# Altium schematic sheet FPGA.SchDoc
size A4; SheetNumber: 3; SheetTotal: 4
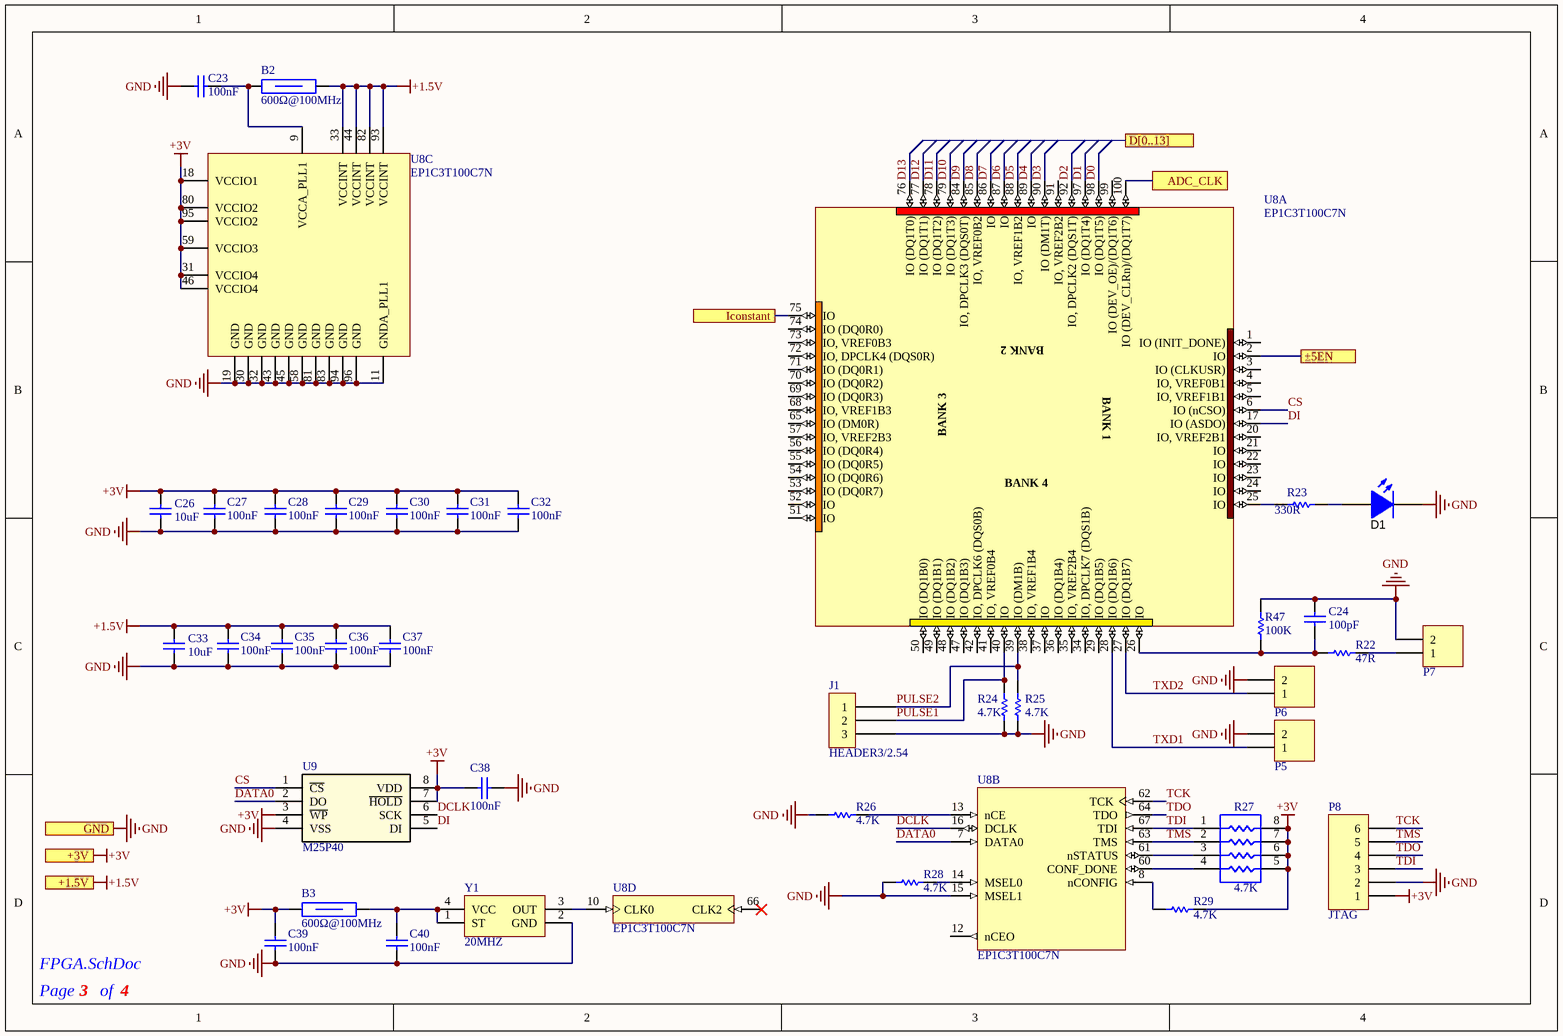
[diagram p0: FPGA.SchDoc]

## Parts
B2  600Ω@100MHz  [R0805_L]
B3  600Ω@100MHz  [R0805_L]
C23  100nF  [R0603_C]
C24  100pF  [R0603_C]
C26  10uF  [R0805_C]
C27  100nF  [R0603_C]
C28  100nF  [R0603_C]
C29  100nF  [R0603_C]
C30  100nF  [R0603_C]
C31  100nF  [R0603_C]
C32  100nF  [R0603_C]
C33  10uF  [R0805_C]
C34  100nF  [R0603_C]
C35  100nF  [R0603_C]
C36  100nF  [R0603_C]
C37  100nF  [R0603_C]
C38  100nF  [R0603_C]
C39  100nF  [R0603_C]
C40  100nF  [R0603_C]
D1  MHT192WDT-C2  [LED_0603_RED]  (value not drawn)
J1  HEADER3/2.54  [SIP3/2.54]
P5  Header 2  [CP1X2]  (value not drawn)
P6  Header 2  [CP1X2]  (value not drawn)
P7  Header 2  [CP1X2]  (value not drawn)
P8  JTAG  [CP1X6]
R22  47R  [R0603_R]
R23  330R  [R0603_R]
R24  4.7K  [R0603_R]
R25  4.7K  [R0603_R]
R26  4.7K  [R0603_R]
R27  4.7K  [R0603X4]
R28  4.7K  [R0603_R]
R29  4.7K  [R0603_R]
R47  100K  [R0603_R]
U8  EP1C3T100C7N  [TQFP100]  (parts A,B,C,D of 4)
U9  M25P40  [SOP-8_150mil]
Y1  20MHZ  [SMD-3225]

## Ports
+1.5V, +3V, ADC_CLK, D[0..13], GND, Iconstant, ±5EN

## Nets
+1.5V: B2.2 C33.1 C34.2 C35.2 C36.2 C37.2 U8.33(VCCINT) U8.44(VCCINT) U8.82(VCCINT) U8.93(VCCINT) ; port +1.5V
+3V: B3.1 C26.2 C27.2 C28.2 C29.2 C30.2 C31.2 C32.2 C38.2 C39.2 P8.1 R27.5 R27.6 R27.7 R27.8 R29.1 U8.18(VCCIO1) U8.31(VCCIO4) U8.46(VCCIO4) U8.59(VCCIO3) U8.80(VCCIO2) U8.95(VCCIO2) U9.3(~{WP}) U9.7(~{HOLD}) U9.8(VDD) ; port +3V
GND: C23.2 C24.1 C26.1 C27.1 C28.1 C29.1 C30.1 C31.1 C32.1 C33.2 C34.1 C35.1 C36.1 C37.1 C38.1 C39.1 C40.1 D1.2(K) J1.3 P5.2 P6.2 P7.2 P8.2 R24.2 R25.2 R26.2 R28.1 R47.1 U8.11(GNDA_PLL1) U8.15(MSEL1) U8.19(GND) U8.30(GND) U8.32(GND) U8.43(GND) U8.45(GND) U8.58(GND) U8.81(GND) U8.83(GND) U8.94(GND) U8.96(GND) U9.4(VSS) Y1.2(GND) ; port GND
ADC_CLK: U8.100(IO_(DEV_CLRn)/(DQ1T7)) ; port ADC_CLK
CS: U8.6(IO_(nCSO)) U9.1(~{CS})
D0: U8.98(IO_(DQ1T5))
D1: U8.97(IO_(DQ1T4))
D2: U8.92(IO,_DPCLK2_(DQS1T))
D3: U8.90(IO_(DM1T))
D4: U8.89(IO)
D5: U8.88(IO,_VREF1B2)
D6: U8.87(IO)
D7: U8.86(IO)
D8: U8.85(IO,_VREF0B2)
D9: U8.84(IO,_DPCLK3_(DQS0T))
D10: U8.79(IO_(DQ1T3))
D11: U8.78(IO_(DQ1T2))
D12: U8.77(IO_(DQ1T1))
D13: U8.76(IO_(DQ1T0))
DATA0: U8.7(DATA0) U9.2(DO)
DCLK: U8.16(DCLK) U9.6(SCK)
DI: U8.17(IO_(ASDO)) U9.5(DI)
Iconstant: U8.75(IO) ; port Iconstant
PULSE1: J1.2 R24.1 U8.40(IO)
PULSE2: J1.1 R25.1 U8.39(IO_(DM1B))
TCK: P8.6 U8.62(TCK)
TDI: P8.3 R27.1 U8.67(TDI)
TDO: P8.4 U8.64(TDO)
TMS: P8.5 R27.2 U8.63(TMS)
TXD1: P5.1 U8.28(IO_(DQ1B6))
TXD2: P6.1 U8.27(IO_(DQ1B7))
±5EN: U8.2(IO) ; port ±5EN
NetB2_1: B2.1 C23.1 U8.9(VCCA_PLL1)
NetB3_2: B3.2 C40.2 Y1.1(ST) Y1.4(VCC)
NetC24_2: C24.2 R22.1 R47.2 U8.26(IO)
NetD1_1: D1.1(A) R23.2
NetP7_1: P7.1 R22.2
NetR23_1: R23.1 U8.25(IO)
NetR26_1: R26.1 U8.13(nCE)
NetR27_3: R27.3 U8.61(nSTATUS)
NetR27_4: R27.4 U8.60(CONF_DONE)
NetR28_2: R28.2 U8.14(MSEL0)
NetR29_2: R29.2 U8.8(nCONFIG)
NetU8_10: U8.10(CLK0) Y1.3(OUT)

Not connected (* = marked no-connect by the designer): U8 1(IO_(INIT_DONE)) 3(IO_(CLKUSR)) 4(IO,_VREF0B1) 5(IO,_VREF1B1) 12(nCEO) 20(IO,_VREF2B1) 21(IO) 22(IO) 23(IO) 24(IO) 29(IO_(DQ1B5)) 34(IO,_DPCLK7_(DQS1B)) 35(IO,_VREF2B4) 36(IO_(DQ1B4)) 37(IO) 38(IO,_VREF1B4) 41(IO,_VREF0B4) 42(IO,_DPCLK6_(DQS0B)) 47(IO_(DQ1B3)) 48(IO_(DQ1B2)) 49(IO_(DQ1B1)) 50(IO_(DQ1B0)) 51(IO) 52(IO) 53(IO_(DQ0R7)) 54(IO_(DQ0R6)) 55(IO_(DQ0R5)) 56(IO_(DQ0R4)) 57(IO,_VREF2B3) 65(IO_(DM0R)) 66(CLK2)* 68(IO,_VREF1B3) 69(IO_(DQ0R3)) 70(IO_(DQ0R2)) 71(IO_(DQ0R1)) 72(IO,_DPCLK4_(DQS0R)) 73(IO,_VREF0B3) 74(IO_(DQ0R0)) 91(IO,_VREF2B2) 99(IO_(DEV_OE)/(DQ1T6))

## Notes on the sheet
- Page
- of
- (in symbol EP1C3T100C7N, part A) BANK 2; BANK 1; BANK 3; BANK 4

## Library data of the parts
B2 B3 = 600Ω@100MHz: 600Ω @ 100MHz / 线路数 1 / 额定电流（最大） 600mA / 直流电阻（DCR）（最大） 210mΩ; 厂家: muRata(村田); 型号: BLM21AG601SN1D; 封装: 0805; 类型: Bead; 订货编码: C85837
C23 C27-C32 C34-C40 = 100nF/0603/50V: 精度 ±10% / 容值 100nF / 额定电压 50V / 温漂系数（介质材料) X7R; 厂家: FH(风华); 型号: 0603B104K500NT; 封装: 0603; 类型: Capacitor; 订货编码: C30926
C24 = 100pF/0603/50V: 精度 ±5% / 容值 100pF / 额定电压 50V / 温漂系数（介质材料) C0G; 厂家: FH(风华); 型号: 0603CG101J500NT; 封装: 0603; 类型: Capacitor; 订货编码: C1635
C26 C33 = 10uF/0805/16V: 精度 ±10% / 容值 10uF / 额定电压 16V / 温漂系数（介质材料) X7R; 厂家: FH(风华); 型号: 0805B106K160NT; 封装: 0805; 类型: Capacitor; 订货编码: C92341
D1 = MHT192WDT-C2: LED SMD贴片0603顶部发光 / 黄色雾状胶体，高亮白色光 / 电压VF:2.6-3.1V@5mA / 亮度Iv:228-450mcd@5mA / 坐标x:0.3,y:0.3 / 发光角度:120deg; 厂家: MEIHUA(美华科技); 封装: 0603; 订货编码: C389521; 型号: MHT192WDT-C2; 类型: LED
J1 = HEADER3/2.54: 3pin,单排,2.54mm间距; 厂家: /; System: Connector; 型号: /; 封装: /; 类型: /; 订货编码: /
P5-P7 = Header 2: Header, 2-Pin; 厂家: /; System: Connector; 型号: /; 封装: /; 类型: /; 订货编码: /
P8 = Header 6: Header, 6-Pin; 厂家: /; System: Connector; 型号: /; 封装: /; 类型: /; 订货编码: /
R22 = 47R/0603: 精度 ±1% / 温度系数 ±100ppm/℃ / 阻值 47Ω / 功率 0.1W; 厂家: FH(风华); 型号: RS-03K47R0FT; 类型: Resistor; 订货编码: C140087; 封装: 0603
R23 = 330R/0603: 精度 ±1% / 温度系数 ±100ppm/℃ / 阻值 330Ω / 功率 0.1W; 厂家: FH(风华); 型号: RS-03K3300FT; 类型: Resistor; 订货编码: C125768; 封装: 0603
R24-R26 R28 R29 = 4.7K/0603: 精度 ±1% / 阻值 4.7kΩ / 温度系数 ±100ppm/℃ / 功率 0.1W; 厂家: FH(风华); 型号: RS-03K4701FT; 类型: Resistor; 订货编码: C116693; 封装: 0603
R27 = 4.7K/0603X4: 4.7K / 电阻器数 4 / 精度 ±1% / 安装类型 表面贴装 / 每元件功率 1/16W / 温度系数 ±200ppm/℃; 厂家: UNI-ROYAL(厚声); 型号: 4D03WGF4701T5E; 类型: Resistor; 订货编码: C66697; 封装: 0603_x4
R47 = 100K/0603: 精度 ±1% / 阻值 100kΩ / 温度系数 ±100ppm/℃ / 功率 0.1W; 厂家: FH(风华); 型号: RS-03K1003FT; 类型: Resistor; 订货编码: C115320; 封装: 0603
U8 = EP1C3T100C7N: Cyclone Family, 1.5V FPGA, 65 I/O Pins, 1 x PLL, Commercial Grade, Speed Grade 7, Pb-Free; 厂家: INTEL; 型号: EP1C3T100C7NA; 封装: TQFP100; 类型: FPGA; 订货编码: -
U9 = M25P40: FLASH - NOR / 4Mb（512K x 8） / SPI / 电压 - 供电 / 2.3V ~ 3.6V / 工作温度 / -40°C ~ 85°C（TA）; 厂家: micron(镁光); 型号: M25P40-VMN6TPB; 封装: SOIC-8; 类型: FLASH存储器; 订货编码: C524852
Y1 = SG-310SCF 20MHZ L: 工作电压 2.7V ~ 3.6V / 主频 20MHz / 频率稳定度 ±50ppm / 工作温度 -40℃~85℃; 厂家: EPSON(爱普生); 型号: Q33310F70051500; 封装: SMD-3225_4P; 类型: 有源晶振; 订货编码: C32529